# EAGLE design vpcb (EAGLE 7.3.0)
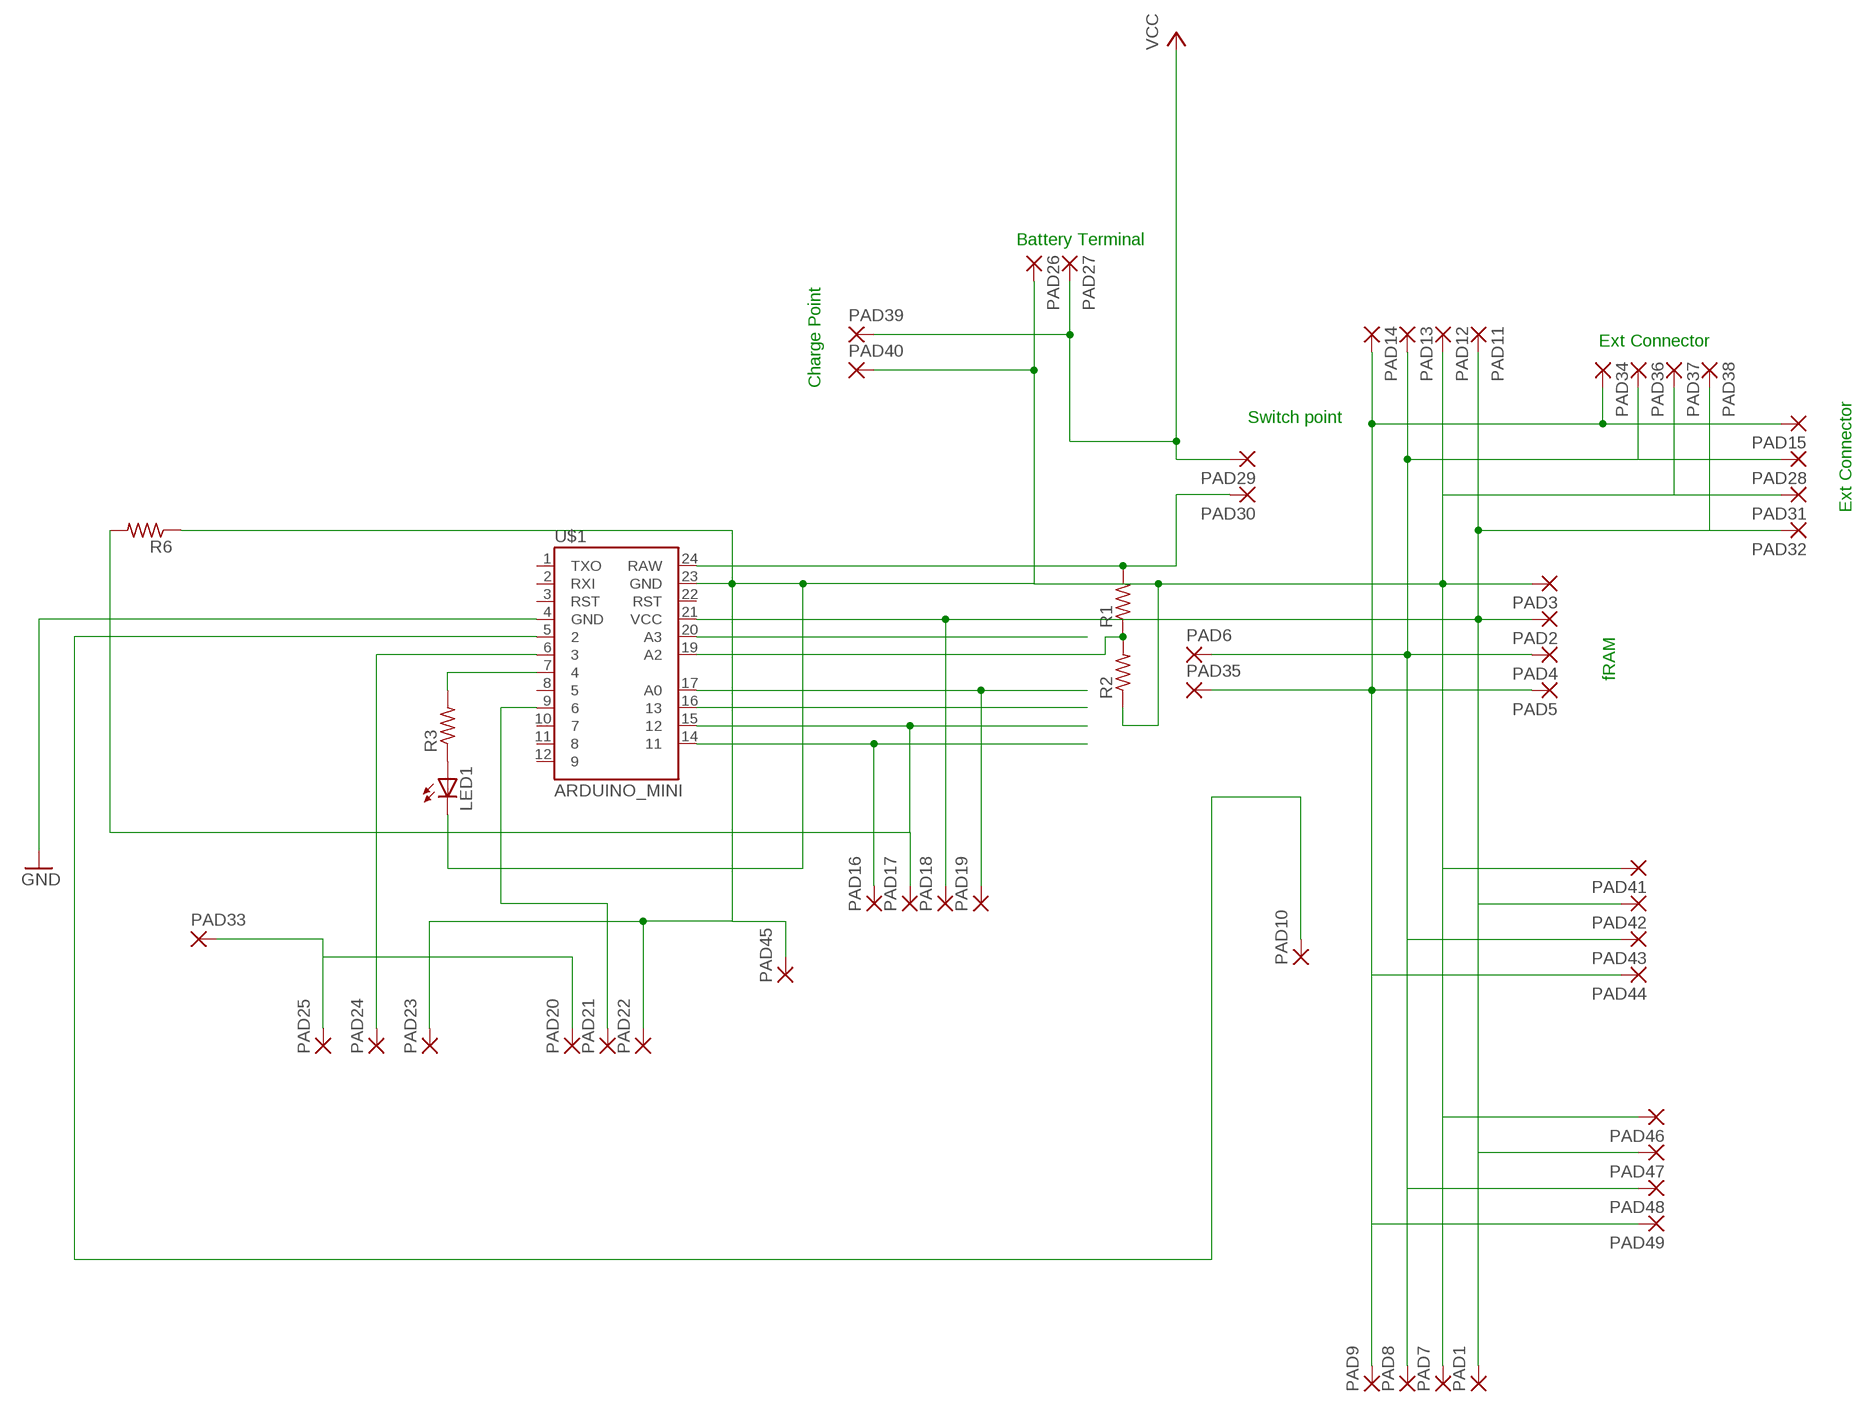
[diagram p0: schematic, sheet 1]

## Parts
LED1  LED3MM  [LED3MM]
PAD1  2,15/1,0  [2,15/1,0]
PAD2  2,15/1,0  [2,15/1,0]
PAD3  2,15/1,0  [2,15/1,0]
PAD4  2,15/1,0  [2,15/1,0]
PAD5  2,15/1,0  [2,15/1,0]
PAD6  2,15/1,0  [2,15/1,0]
PAD7  2,15/1,0  [2,15/1,0]
PAD8  2,15/1,0  [2,15/1,0]
PAD9  2,15/1,0  [2,15/1,0]
PAD10  2,15/1,0  [2,15/1,0]
PAD11  2,15/1,0  [2,15/1,0]
PAD12  2,15/1,0  [2,15/1,0]
PAD13  2,15/1,0  [2,15/1,0]
PAD14  2,15/1,0  [2,15/1,0]
PAD15  2,15/1,0  [2,15/1,0]
PAD16  2,15/1,0  [2,15/1,0]
PAD17  2,15/1,0  [2,15/1,0]
PAD18  2,15/1,0  [2,15/1,0]
PAD19  2,15/1,0  [2,15/1,0]
PAD20  2,15/1,0  [2,15/1,0]
PAD21  2,15/1,0  [2,15/1,0]
PAD22  2,15/1,0  [2,15/1,0]
PAD23  2,15/1,0  [2,15/1,0]
PAD24  2,15/1,0  [2,15/1,0]
PAD25  2,15/1,0  [2,15/1,0]
PAD26  2,15/1,0  [2,15/1,0]
PAD27  2,15/1,0  [2,15/1,0]
PAD28  2,15/1,0  [2,15/1,0]
PAD29  2,15/1,0  [2,15/1,0]
PAD30  2,15/1,0  [2,15/1,0]
PAD31  2,15/1,0  [2,15/1,0]
PAD32  2,15/1,0  [2,15/1,0]
PAD33  2,15/1,0  [2,15/1,0]
PAD34  2,15/1,0  [2,15/1,0]
PAD35  2,15/1,0  [2,15/1,0]
PAD36  2,15/1,0  [2,15/1,0]
PAD37  2,15/1,0  [2,15/1,0]
PAD38  2,15/1,0  [2,15/1,0]
PAD39  2,15/1,0  [2,15/1,0]
PAD40  2,15/1,0  [2,15/1,0]
PAD41  2,15/1,0  [2,15/1,0]
PAD42  2,15/1,0  [2,15/1,0]
PAD43  2,15/1,0  [2,15/1,0]
PAD44  2,15/1,0  [2,15/1,0]
PAD45  2,15/1,0  [2,15/1,0]
PAD46  2,15/1,0  [2,15/1,0]
PAD47  2,15/1,0  [2,15/1,0]
PAD48  2,15/1,0  [2,15/1,0]
PAD49  2,15/1,0  [2,15/1,0]
R1  R-US_0204/7  [0204/7]
R2  R-US_0204/7  [0204/7]
R3  R-US_0204/7  [0204/7]
R6  R-US_0204/5  [0204/5]
U$1  ARDUINO_MINI  [ARDUINO_MINI]

## Nets
GND: U$1.4(GND)
N$1: PAD4.1(P) PAD6.1(P) PAD8.1(P) PAD13.1(P) PAD28.1(P) PAD36.1(P) PAD43.1(P) PAD48.1(P)
N$2: PAD5.1(P) PAD9.1(P) PAD14.1(P) PAD15.1(P) PAD34.1(P) PAD35.1(P) PAD44.1(P) PAD49.1(P)
N$3: PAD1.1(P) PAD2.1(P) PAD11.1(P) PAD18.1(P) PAD32.1(P) PAD38.1(P) PAD42.1(P) PAD47.1(P) U$1.21(VCC)
N$5: PAD30.1(P) R1.2 U$1.24(RAW)
N$6: PAD10.1(P) U$1.5
N$7: U$1.16
N$8: PAD20.1(P) PAD25.1(P) PAD33.1(P)
N$9: U$1.20(A3)
N$10: R1.1 R2.2 U$1.19(A2)
N$11: LED1.A R3.1
N$12: PAD19.1(P) U$1.17(A0)
N$13: R3.2 U$1.7
N$14: PAD24.1(P) U$1.6
N$15: PAD21.1(P) U$1.9
N$16: LED1.K(C) PAD3.1(P) PAD7.1(P) PAD12.1(P) PAD22.1(P) PAD23.1(P) PAD26.1(P) PAD31.1(P) PAD37.1(P) PAD40.1(P) PAD41.1(P) PAD45.1(P) PAD46.1(P) R2.1 R6.1 U$1.23(GND)
N$17: PAD17.1(P) R6.2 U$1.15
N$20: PAD16.1(P) U$1.14
VCC: PAD27.1(P) PAD29.1(P) PAD39.1(P)
Unconnected: U$1.1(TXO) U$1.2(RXI) U$1.3(RST) U$1.8 U$1.10 U$1.11 U$1.12 U$1.22(RST)

## Notes on the sheet
- Battery Terminal
- Ext Connector
- Charge Point
- Switch point
- Ext Connector
- fRAM

## Library data of the parts
LED1 = led:LED: LED OSRAM: - CHIPLED LG R971, LG N971, LY N971, LG Q971, LY Q971, LO R971, LY R971 LH N974, LH R974 LS Q976, LO Q976, LY Q976 LO Q996 - Hyper CHIPLED LW Q18S LB Q993, LB Q99A, LB R99A - SideLED LS A670, LO A670, LY A670, LG A670, LP A670 LB A673, LV A673, LT A673, LW A673 LH A674 LY A675 LS A676, LA A676, LO A676, LY A676, LW A676 LS A679, LY A679, LG A679 - Hyper Micro SIDELED® LS Y876, LA Y876, LO Y876, LY Y876 LT Y87S - SmartLED LW L88C, LW L88S LB L89C, LB L89S, LG L890 LS L89K, LO L89K, LY L89K LS L896, LA L896, LO L896, LY L896 - TOPLED LS T670, LO T670, LY T670, LG T670, LP T670 LSG T670, LSP T670, LSY T670, LOP T670, LYG T670 LG T671, LOG T671, LSG T671 LB T673, LV T673, LT T673, LW T673 LH T674 LS T676, LA T676, LO T676, LY T676, LB T676, LH T676, LSB T676, LW T676 LB T67C, LV T67C, LT T67C, LS T67K, LO T67K, LY T67K, LW E67C LS E67B, LA E67B, LO E67B, LY E67B, LB E67C, LV E67C, LT E67C LW T67C LS T679, LY T679, LG T679 LS T770, LO T770, LY T770, LG T770, LP T770 LB T773, LV T773, LT T773, LW T773 LH T774 LS E675, LA E675, LY E675, LS T675 LS T776, LA T776, LO T776, LY T776, LB T776 LHGB T686 LT T68C, LB T68C - Hyper Mini TOPLED® LB M676 - Mini TOPLED Santana® LG M470 LS M47K, LO M47K, LY M47K Source: http://www.osram.convergy.de LUXEON: - LUMILED® LXK2-PW12-R00, LXK2-PW12-S00, LXK2-PW14-U00, LXK2-PW14-V00 LXK2-PM12-R00, LXK2-PM12-S00, LXK2-PM14-U00 LXK2-PE12-Q00, LXK2-PE12-R00, LXK2-PE12-S00, LXK2-PE14-T00, LXK2-PE14-U00 LXK2-PB12-K00, LXK2-PB12-L00, LXK2-PB12-M00, LXK2-PB14-N00, LXK2-PB14-P00, LXK2-PB14-Q00 LXK2-PR12-L00, LXK2-PR12-M00, LXK2-PR14-Q00, LXK2-PR14-R00 LXK2-PD12-Q00, LXK2-PD12-R00, LXK2-PD12-S00 LXK2-PH12-R00, LXK2-PH12-S00 LXK2-PL12-P00, LXK2-PL12-Q00, LXK2-PL12-R00 Source: www.luxeon.com KINGBRIGHT: KA-3528ASYC Source: www.kingbright.com
PAD1-PAD49 = wirepad:2,15/1,0: THROUGH-HOLE PAD
R1-R3 = resistor:R-US_: RESISTOR, American symbol
R6 = rcl:R-US_: RESISTOR, American symbol
U$1 = vPCB_Joe_SparkFun-Boards:ARDUINO_MINI: Arduino Pro Mini footprint

## Board
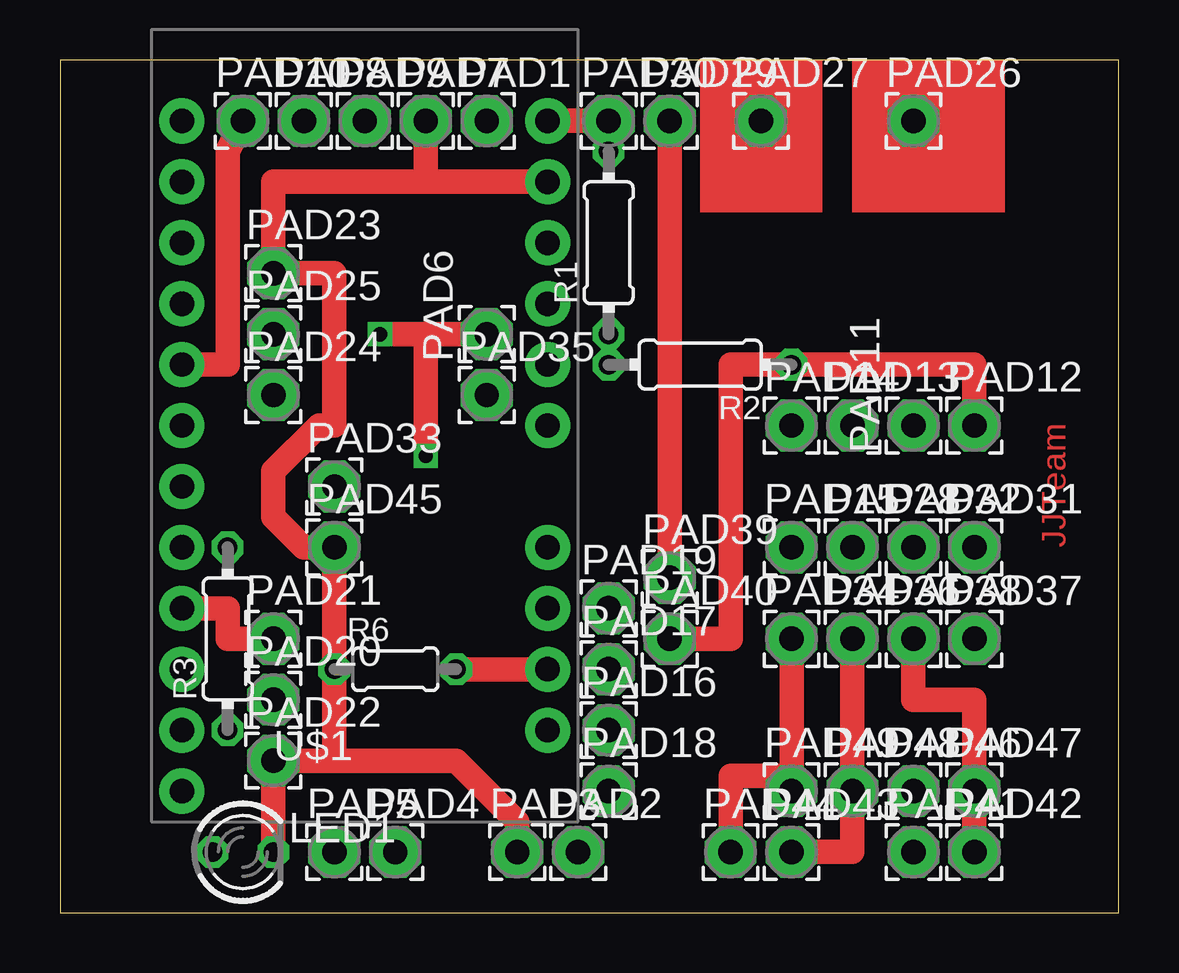
[diagram p1: board, top side]
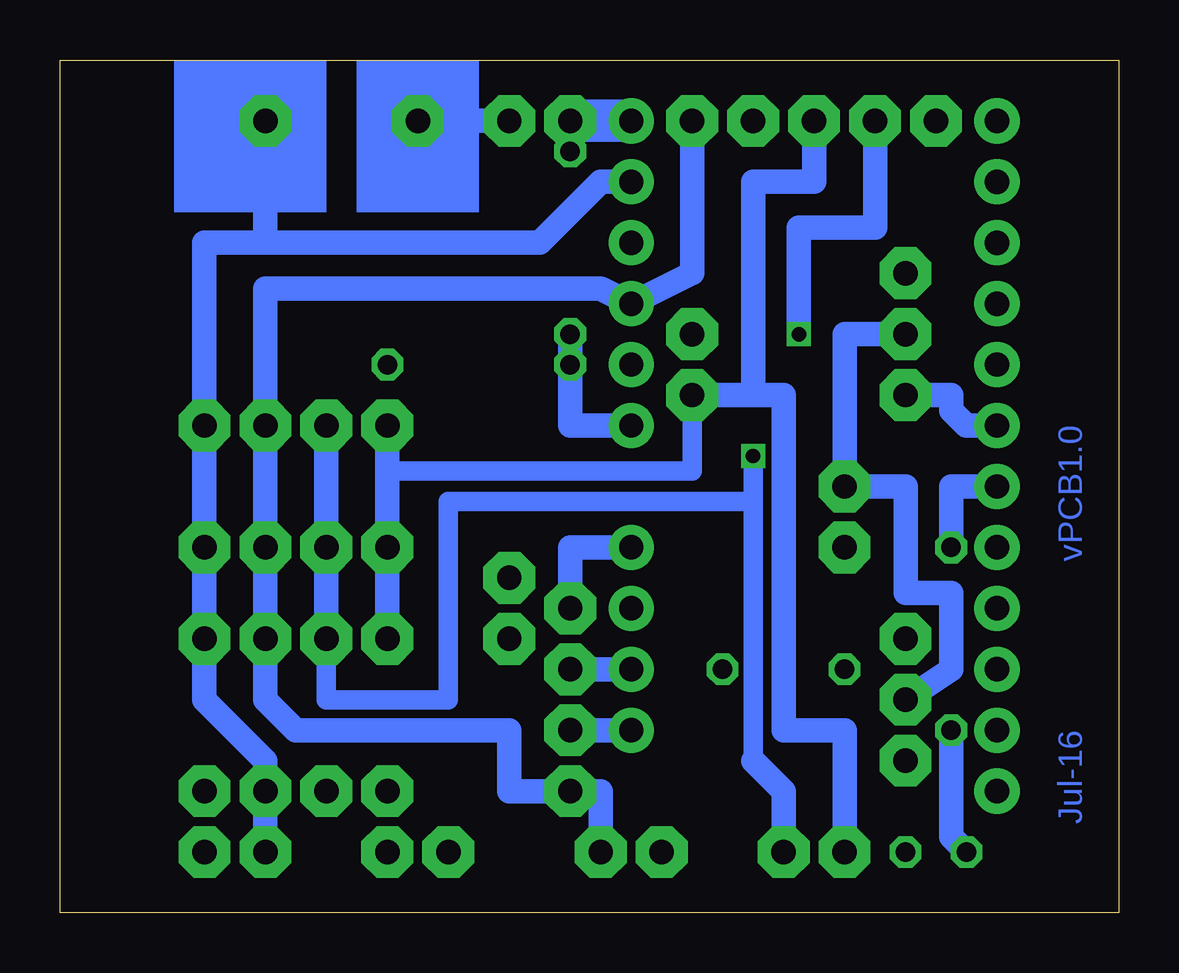
[diagram p2: board, bottom side, seen from below]

Size 44.12 x 35.55 mm. Coordinates in mm from the lower left corner, seen from the top.
Outline: 0,0 44.12,0 44.12,35.55 0,35.55 0,0
Copper layers (1*16): Top 0.035mm / dielectric 1.5mm / Bottom 0.035mm
Design rules "default": minimum track width 10mil, minimum drill 24mil, track to track 8mil, track to pad 8mil, pad to pad 8mil, via to via 8mil, smd to smd 8mil, copper to edge 40mil, drill to drill 8mil, minimum pad ring 10mil, minimum via ring 8mil, stop-mask expansion 4mil, vias tented up to drill 0mil, thermal gap 10mil

### Footprints (pad centres in the part's own frame; a part is rotated, then mirrored left to right if it is on the bottom)
LED3MM = drill 0.813 octagon: A -1.27,0; K 1.27,0
2,15/1,0 = drill 1.016 pad 2.159 octagon: 1 0,0
0204/7 = drill 0.813 octagon: 1 -3.81,0; 2 3.81,0
0204/5 = drill 0.813 octagon: 1 -2.54,0; 2 2.54,0
ARDUINO_MINI = drill 1.016 pad 1.88: 1 -7.62,12.7; 2 -7.62,10.16; 3 -7.62,7.62; 4 -7.62,5.08; 5 -7.62,2.54; 6 -7.62,0; 7 -7.62,-2.54; 8 -7.62,-5.08; 9 -7.62,-7.62; 10 -7.62,-10.16; 11 -7.62,-12.7; 12 -7.62,-15.24; 14 7.62,-12.7; 15 7.62,-10.16; 16 7.62,-7.62; 17 7.62,-5.08; 19 7.62,0; 20 7.62,2.54; 21 7.62,5.08; 22 7.62,7.62; 23 7.62,10.16; 24 7.62,12.7

### Placement (x,y rotation side)
LED1  7.62,2.54 0 top
PAD1  17.78,33.02 0 top
PAD2  21.59,2.54 0 top
PAD3  19.05,2.54 0 top
PAD4  13.97,2.54 0 top
PAD5  11.43,2.54 0 top
PAD6  17.78,24.13 90 top
PAD7  15.24,33.02 0 top
PAD8  10.16,33.02 0 top
PAD9  12.7,33.02 0 top
PAD10  7.62,33.02 0 top
PAD11  35.56,20.32 90 top
PAD12  38.1,20.32 0 top
PAD13  33.02,20.32 0 top
PAD14  30.48,20.32 0 top
PAD15  30.48,15.24 0 top
PAD16  22.86,7.62 0 top
PAD17  22.86,10.16 0 top
PAD18  22.86,5.08 0 top
PAD19  22.86,12.7 0 top
PAD20  8.89,8.89 0 top
PAD21  8.89,11.43 0 top
PAD22  8.89,6.35 0 top
PAD23  8.89,26.67 0 top
PAD24  8.89,21.59 0 top
PAD25  8.89,24.13 0 top
PAD26  35.56,33.02 0 top
PAD27  29.21,33.02 0 top
PAD28  33.02,15.24 0 top
PAD29  25.4,33.02 0 top
PAD30  22.86,33.02 0 top
PAD31  38.1,15.24 0 top
PAD32  35.56,15.24 0 top
PAD33  11.43,17.78 0 top
PAD34  30.48,11.43 0 top
PAD35  17.78,21.59 0 top
PAD36  33.02,11.43 0 top
PAD37  38.1,11.43 0 top
PAD38  35.56,11.43 0 top
PAD39  25.4,13.97 0 top
PAD40  25.4,11.43 0 top
PAD41  35.56,2.54 0 top
PAD42  38.1,2.54 0 top
PAD43  30.48,2.54 0 top
PAD44  27.94,2.54 0 top
PAD45  11.43,15.24 0 top
PAD46  35.56,5.08 0 top
PAD47  38.1,5.08 0 top
PAD48  33.02,5.08 0 top
PAD49  30.48,5.08 0 top
R1  22.86,27.94 90 top
R2  26.67,22.86 180 top
R3  6.98,11.43 90 top
R6  13.97,10.16 0 top
U$1  12.7,20.32 0 top

### Tracks (layer width: path | path; a pad name or v marks a point on that pad's centre or on a via)
N$1  (via drill 0.6)
  Top 1.016: PAD43.1 33.02,2.54 PAD48.1 PAD36.1 | v13.33,24.13 PAD6.1 15.24,24.13 v15.24,19.05
  Bottom 0.813: 15.24,6.35 15.24,17.15 | 15.24,17.15 27.94,17.15 27.94,8.89 33.02,8.89 PAD36.1 | 15.24,17.15 v15.24,19.05
  Bottom 1.016: PAD36.1 PAD28.1 PAD13.1 | PAD4.1 13.97,5.08 15.24,6.35 | PAD8.1 10.16,28.58 13.33,28.58 v13.33,24.13
N$2
  Top 1.016: PAD44.1 27.94,5.72 30.48,5.72 | 30.48,5.72 PAD34.1 | PAD49.1 30.48,5.72
  Bottom 0.813: PAD35.1 17.78,18.41 30.48,18.41
  Bottom 1.016: 30.48,19.05 PAD14.1 30.48,18.41 PAD15.1 PAD34.1 | PAD9.1 12.7,30.48 15.24,30.48 15.24,21.59 | 15.24,21.59 PAD35.1 | PAD5.1 11.43,7.62 13.97,7.62 13.97,21.59 15.24,21.59
N$3
  Top 1.016: PAD38.1 35.56,8.89 38.1,8.89 PAD47.1 PAD42.1
  Bottom 1.016: PAD2.1 21.59,5.08 PAD18.1 25.4,5.08 25.4,7.62 34.29,7.62 35.56,8.89 PAD38.1 PAD32.1 PAD11.1 35.56,26.04 21.59,26.04 U$1.21 17.78,26.67 PAD1.1
N$5
  Top 1.016: U$1.24 PAD30.1
  Bottom 1.016: R1.2 PAD30.1
  Bottom 1.778: PAD30.1 U$1.24
N$6
  Top 1.016: U$1.5 6.98,22.86 6.98,31.75 PAD10.1
N$8
  Bottom 1.016: PAD25.1 11.43,24.13 PAD33.1 8.89,17.78 8.89,13.34 6.98,13.34 6.98,10.16 PAD20.1
N$10
  Bottom 1.016: U$1.19 22.86,20.32 R2.2 R1.1
N$11
  Bottom 1.016: R3.1 6.98,3.18 LED1.A
N$12
  Bottom 1.016: U$1.17 22.86,15.24 PAD19.1
N$13
  Bottom 1.016: U$1.7 6.98,17.78 R3.2
N$14
  Bottom 1.016: U$1.6 6.35,20.32 6.98,20.95 6.98,21.59 PAD24.1
N$15
  Top 1.016: U$1.9 6.98,12.7 6.98,11.43 PAD21.1
N$16
  Top 1.016: U$1.23 15.24,30.48 | PAD7.1 15.24,30.48 | 15.24,30.48 8.89,30.48 PAD23.1 11.43,26.67 11.43,20.32 10.8,20.32 8.89,18.41 8.89,16.51 10.16,15.24 PAD45.1 R6.1 11.43,6.35 | 11.43,6.35 PAD22.1 LED1.K | PAD3.1 19.05,3.81 16.51,6.35 11.43,6.35 | PAD12.1 38.1,22.86 R2.1 27.94,22.86 27.94,11.43 PAD40.1
  Bottom 1.016: 35.56,27.94 38.1,27.94 PAD12.1 PAD31.1 PAD37.1 38.1,8.89 35.56,6.35 PAD46.1 PAD41.1 | 35.56,27.94 PAD26.1 | 35.56,27.94 24.13,27.94 21.59,30.48 U$1.23
N$17
  Top 1.016: R6.2 U$1.15
  Bottom 1.016: PAD17.1 U$1.15
N$20
  Bottom 1.016: PAD16.1 U$1.14
VCC
  Top 1.016: PAD29.1 PAD39.1
  Bottom 1.016: PAD27.1 PAD29.1
(copper drawn outside any net)
  shapes: Bottom area x11, Top area x12

### Text on the board
Top: JJTeam
Bottom: vPCB1.0 | Jul-16